# Altium schematic sheet Display Buttons.SchDoc
size A; DocumentNumber: 4; SheetNumber: 4; SheetTotal: 4
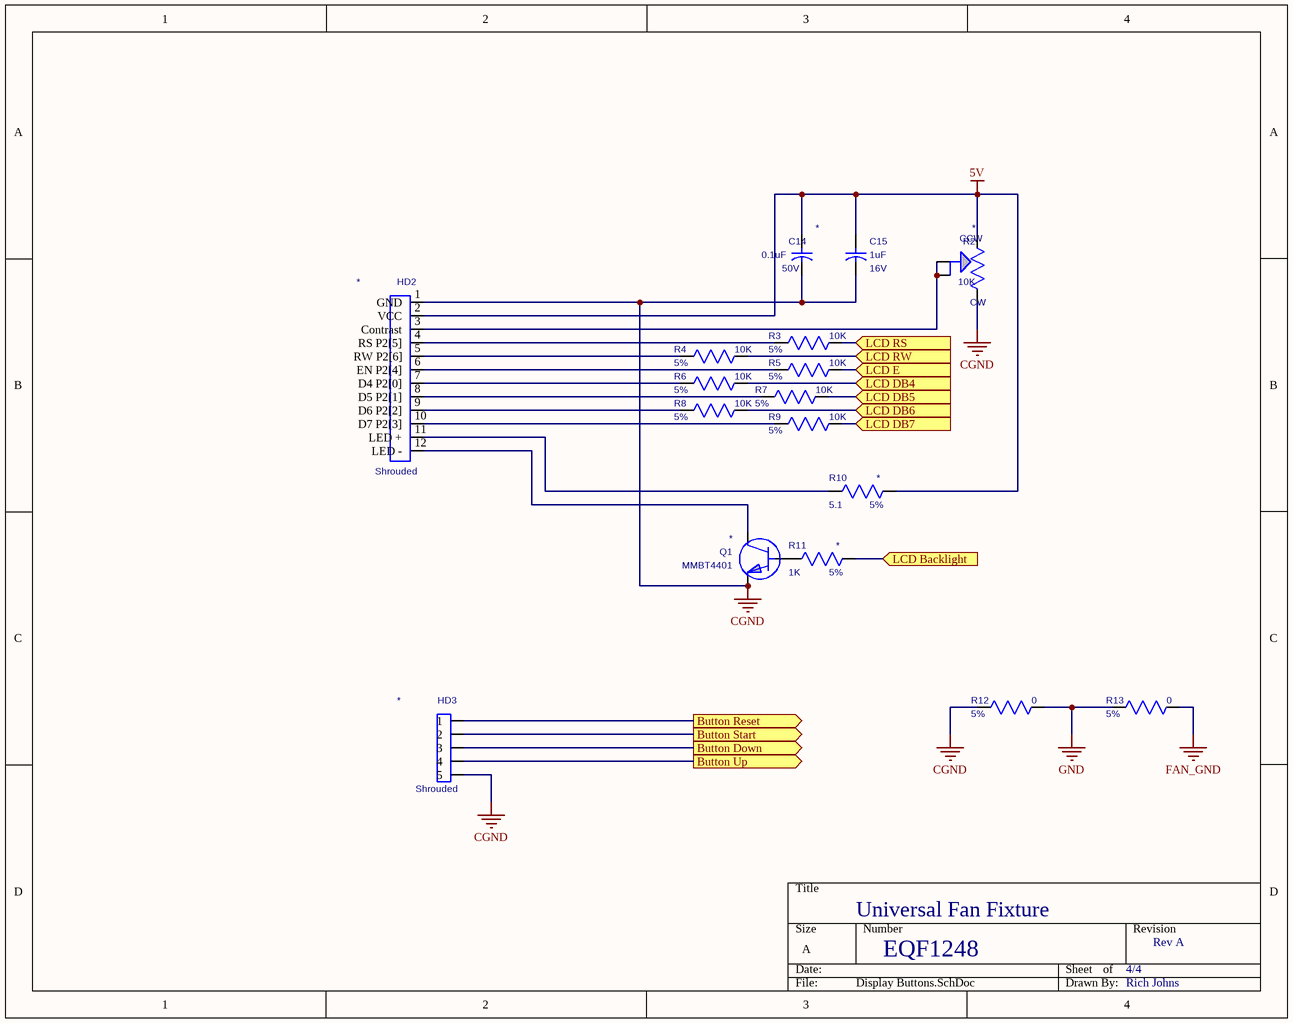
[diagram p0: Display Buttons.SchDoc]

## Parts
C14  value 0.1uF  Voltage: 50V  [0603]  (hidden comment: CAP_NON_POLAR_SMT)
C15  value 1uF  Voltage: 16V  [0603]  (hidden comment: 1.0uF_0603_16V)
HD2  HeaderType: Shrouded  [HDR12PIN100SHRD]  (hidden comment: HDR12PIN100SHRD)
HD3  HeaderType: Shrouded  [HDR5PIN100SHRD]  (hidden comment: HDR5PIN100SHRD)
Q1  value MMBT4401  [SOT23-3]  (hidden comment: NPN_TRANSISTOR)
R2  value 10K  [6MM POT]  (hidden comment: POT 6MM 10K)
R3  value 10K  Tolerance: 5%  [0603]  (hidden comment: Resistor_0603_5%)
R4  value 10K  Tolerance: 5%  [0603]  (hidden comment: Resistor_0603_5%)
R5  value 10K  Tolerance: 5%  [0603]  (hidden comment: Resistor_0603_5%)
R6  value 10K  Tolerance: 5%  [0603]  (hidden comment: Resistor_0603_5%)
R7  value 10K  Tolerance: 5%  [0603]  (hidden comment: Resistor_0603_5%)
R8  value 10K  Tolerance: 5%  [0603]  (hidden comment: Resistor_0603_5%)
R9  value 10K  Tolerance: 5%  [0603]  (hidden comment: Resistor_0603_5%)
R10  value 5.1  Tolerance: 5%  [RC0603REFLOW-IPC]  (hidden comment: R0603REFLOW_5%)
R11  value 1K  Tolerance: 5%  [RC0603REFLOW-IPC]  (hidden comment: R0603REFLOW_5%)
R12  value 0  Tolerance: 5%  [0603]  (hidden comment: Resistor_0603_5%)
R13  value 0  Tolerance: 5%  [0603]  (hidden comment: Resistor_0603_5%)

## Ports
Button Down (out), Button Reset (out), Button Start (out), Button Up (out), LCD Backlight (in), LCD DB4 (in), LCD DB5 (in), LCD DB6 (in), LCD DB7 (in), LCD E (in), LCD RS (in), LCD RW (in)

## Nets
5V: C14.1(pin1) C15.1(pin1) HD2.2(VCC) R2.1 R10.1(pin1)
CGND: C14.2(pin2) C15.2(pin2) HD2.1(GND) HD3.5 Q1.2(emitter) R2.4 R12.2(pin2)
FAN_GND: R13.1(pin1)
GND: R12.1(pin1) R13.2(pin2)
Button Down: HD3.3 ; port Button Down
Button Reset: HD3.1 ; port Button Reset
Button Start: HD3.2 ; port Button Start
Button Up: HD3.4 ; port Button Up
LCD Backlight: R11.1(pin1) ; port LCD Backlight
LCD DB4: R6.1(pin1) ; port LCD DB4
LCD DB5: R7.1(pin1) ; port LCD DB5
LCD DB6: R8.1(pin1) ; port LCD DB6
LCD DB7: R9.1(pin1) ; port LCD DB7
LCD E: R5.1(pin1) ; port LCD E
LCD RS: R3.1(pin1) ; port LCD RS
LCD RW: R4.1(pin1) ; port LCD RW
NetHD2_3: HD2.3(Contrast) R2.2 R2.3
NetHD2_4: HD2.4(RS_P2[5]) R3.2(pin2)
NetHD2_5: HD2.5(RW_P2[6]) R4.2(pin2)
NetHD2_6: HD2.6(EN_P2[4]) R5.2(pin2)
NetHD2_7: HD2.7(D4_P2[0]) R6.2(pin2)
NetHD2_8: HD2.8(D5_P2[1]) R7.2(pin2)
NetHD2_9: HD2.9(D6_P2[2]) R8.2(pin2)
NetHD2_10: HD2.10(D7_P2[3]) R9.2(pin2)
NetHD2_11: HD2.11(LED_+) R10.2(pin2)
NetHD2_12: HD2.12(LED_-) Q1.3(collector)
NetQ1_1: Q1.1(base) R11.2(pin2)

Not connected (* = marked no-connect by the designer): HD2 13; HD3 6

## Notes on the sheet
- Universal Fan Fixture
- EQF1248
- 4/4
- Rev A
- Rich Johns
- (in symbol 6440) CCW; CW

## Library data of the parts
C14 = 264790: Capacitor, 0.1uF, 50V, Ceramic, X7R, +/- 20%, Non-Polar, 0603, Kemet: C0603C104M5RACTU or equivalent; plIDX: 264790; Tolerance: +/- 20%; CheckedBy: Sam Rhoufiry; DNS: *; ComponentType: Capacitor; CreatedBy: Mike Tyger; LastUpdatedBy: Mike Tyger; Cost: 0.01; Composition: Ceramic; CapType: X7R; Polarity: Non-Polar; Package: 0603; Vendor: Kemet: C0603C104M5RACTU or equivalent; ComponentLink4URL: https://pdm.iconfitness.com/PDM/EBOM/PartsMaintenance/PartsMaintenance.aspx?Editplidx=264790; ComponentLink4Description: PDM Parts Maintenance
C15 = 18838: Capacitor, 1uF, 16V, Ceramic, X5R, +/- 10%, Non-Polar, 0603, 2, MURATA: GRM188R61C105KA93D OR EQUIVALENT; Tolerance: +/- 10%; plIDX: 18838; Composition: Ceramic; Package: 0603; CapType: X5R; Polarity: Non-Polar; Vendor: MURATA: GRM188R61C105KA93D OR EQUIVALENT; CheckedBy: gdeguzman; ModifyDate: 3/9/10; ComponentType: Capacitor; Supplier 1: Digi-Key; Supplier Part Number 1: 490-1536-2-ND; LastUpdatedBy: Rui Zhang; Cost: 0.001; Pins: 2; ComponentLink4URL: https://pdm.iconfitness.com/PDM/EBOM/PartsMaintenance/PartsMaintenance.aspx?Editplidx=18838; ComponentLink4Description: PDM Parts Maintenance
HD2 = 1763: Header, 0.1 in., 12 pins Pins, Shrouded, AMP: 1-64486-2; LeadSpacing: 0.1 in.; PackageOutlineLayer: PackageOutline; IDF_COMP: 1; plIDX: 1763; Pins: 12 pins; Vendor: AMP: 1-64486-2; CheckedBy: Michael Angeli; Datasheet: g:\accel_lib\datasheets\MTA-AMP.pdf; ModifyDate: 07/30/2008 17:40:27; ComponentHeight: 625mil; ComponentType: Header; DNS: *; Cost: 0.24; ComponentLink4URL: https://pdm.iconfitness.com/PDM/EBOM/PartsMaintenance/PartsMaintenance.aspx?Editplidx=1763; ComponentLink4Description: PDM Parts Maintenance
HD3 = 1770: Header, 0.100 in., 5 pin Pins, Shrouded, AMP: 644486-5; IDF_COMP: 1; plIDX: 1770; LeadSpacing: 0.100 in.; Pins: 5 pin; Vendor: AMP: 644486-5; CheckedBy: Michael Angeli; Datasheet: g:\accel_lib\datasheets\MTA-AMP.pdf; ModifyDate: 07/30/2008 17:40:27; ComponentHeight: 625mil; ComponentType: Header; DNS: *; Cost: 0.08; ComponentLink4URL: https://pdm.iconfitness.com/PDM/EBOM/PartsMaintenance/PartsMaintenance.aspx?Editplidx=1770; ComponentLink4Description: PDM Parts Maintenance
Q1 = 265442: Transistor, MMBT4401, 40V, SOT23-3, 500mA, NPN, Transistor, On Semi: MMBT4401LT1; plIDX: 265442; CheckedBy: gdeguzman; DNS: *; ComponentType: Transistor; CreatedBy: Mike Tyger; LastUpdatedBy: Mike Tyger; Cost: 0.0094; Voltage: 40V; Package: SOT23-3; Amperage: 500mA; TransistorType: NPN; ChipType: Transistor; Vendor: On Semi: MMBT4401LT1; ComponentLink4URL: https://pdm.iconfitness.com/PDM/EBOM/PartsMaintenance/PartsMaintenance.aspx?Editplidx=265442; ComponentLink4Description: PDM Parts Maintenance
R2 = 6440: Resistor, 10K, Carbon, 20%, 0.2 in X 0.1 in or 0.2 in X 0.2 in, 0.1W, Panasonic: EVN-D8AA03B14; plIDX: 6440; Wattage: 0.1W; Tolerance: 20%; LeadSpacing: 0.2 in X 0.1 in or 0.2 in X 0.2 in; Composition: Carbon; Vendor: Panasonic: EVN-D8AA03B14; CheckedBy: B. Lyon; DNS: *; ComponentType: Resistor; Cost: 0.001; ComponentLink4URL: https://pdm.iconfitness.com/PDM/EBOM/PartsMaintenance/PartsMaintenance.aspx?Editplidx=6440; ComponentLink4Description: PDM Parts Maintenance
R3-R9 = 18857: Resistor, 10K, ThickFilm, 5%, 0603, 1/10W, 2, Any; plIDX: 18857; Wattage: 1/10W; Composition: ThickFilm; Package: 0603; Vendor: Any; CheckedBy: Joe Diffie; ModifyDate: 3/9/10; ComponentType: Resistor; LastUpdatedBy: Rui Zhang; Cost: 0.0004; Pins: 2; ComponentLink4URL: https://pdm.iconfitness.com/PDM/EBOM/PartsMaintenance/PartsMaintenance.aspx?Editplidx=18857; ComponentLink4Description: PDM Parts Maintenance
R10 = 13093: Resistor, 5.1, ThickFilm, 5%, 0603, 1/10W, Any; Notes: .; plIDX: 13093; Wattage: 1/10W; Composition: ThickFilm; Package: 0603; Vendor: Any; CheckedBy: Michael Angeli; ModifyDate: 03/02/2004 17:13:13; ComponentType: Resistor; DNS: *; Cost: 0.005; ComponentLink4URL: https://pdm.iconfitness.com/PDM/EBOM/PartsMaintenance/PartsMaintenance.aspx?Editplidx=13093; ComponentLink4Description: PDM Parts Maintenance
R11 = 2044: Resistor, 1K, ThickFilm, 5%, 0603, 1/10W, Any; Notes: .; plIDX: 2044; Wattage: 1/10W; Composition: ThickFilm; Package: 0603; Vendor: Any; CheckedBy: Michael Angeli; ModifyDate: 03/02/2004 17:13:13; ComponentType: Resistor; DNS: *; Cost: 0.001; ComponentLink4URL: https://pdm.iconfitness.com/PDM/EBOM/PartsMaintenance/PartsMaintenance.aspx?Editplidx=2044; ComponentLink4Description: PDM Parts Maintenance
R12 R13 = 18844: Resistor, 0, ThickFilm, 5%, 0603, 1/10W, 2, Any; plIDX: 18844; Wattage: 1/10W; Composition: ThickFilm; Package: 0603; Vendor: Any; CheckedBy: Joe Diffie; ModifyDate: 3/9/10; ComponentType: Resistor; LastUpdatedBy: Rui Zhang; Cost: 0.0004; Pins: 2; ComponentLink4URL: https://pdm.iconfitness.com/PDM/EBOM/PartsMaintenance/PartsMaintenance.aspx?Editplidx=18844; ComponentLink4Description: PDM Parts Maintenance